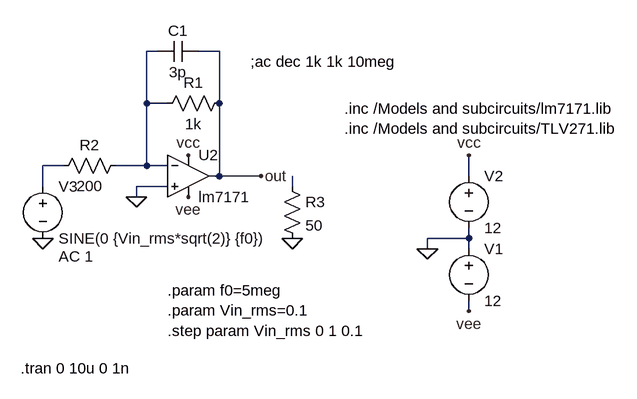
[diagram p0: schematic test_LM7171.asc]
test_LM7171.asc, the LTspice schematic file:
Version 4
SHEET 1 880 680
WIRE 32 32 16 32
WIRE 128 32 96 32
WIRE 16 112 16 32
WIRE 48 112 16 112
WIRE 128 112 128 32
WIRE -112 208 -144 208
WIRE 16 208 16 112
WIRE 16 208 -32 208
WIRE 48 208 16 208
WIRE 128 224 128 112
WIRE 128 224 112 224
WIRE 192 224 128 224
WIRE 512 224 512 192
WIRE -144 240 -144 208
WIRE 48 240 0 240
WIRE 240 240 240 224
WIRE 0 256 0 240
WIRE 512 320 512 304
WIRE 512 320 448 320
WIRE 448 336 448 320
WIRE 512 336 512 320
WIRE 512 432 512 416
FLAG 0 256 0
FLAG 448 336 0
FLAG 512 192 vcc
FLAG 80 192 vcc
FLAG 512 432 vee
FLAG 80 256 vee
FLAG -144 320 0
FLAG 240 320 0
FLAG 192 224 out
SYMBOL voltage 512 320 R0
WINDOW 123 0 0 Left 0
WINDOW 39 0 0 Left 0
SYMATTR InstName V1
SYMATTR Value 12
SYMBOL voltage 512 208 R0
WINDOW 123 0 0 Left 0
WINDOW 39 0 0 Left 0
SYMATTR InstName V2
SYMATTR Value 12
SYMBOL res 144 96 R90
WINDOW 0 0 56 VBottom 2
WINDOW 3 32 56 VTop 2
SYMATTR InstName R1
SYMATTR Value 1k
SYMBOL res -16 192 R90
WINDOW 0 0 56 VBottom 2
WINDOW 3 32 56 VTop 2
SYMATTR InstName R2
SYMATTR Value 200
SYMBOL voltage -144 224 R0
WINDOW 123 24 124 Left 2
WINDOW 39 0 0 Left 0
SYMATTR InstName V3
SYMATTR Value SINE(0 {Vin_rms*sqrt(2)} {f0})
SYMATTR Value2 AC 1
SYMBOL Opamps\\opamp2 80 160 R0
SYMATTR InstName U2
SYMATTR Value lm7171
SYMBOL res 224 224 R0
SYMATTR InstName R3
SYMATTR Value 50
SYMBOL cap 96 16 R90
WINDOW 0 0 32 VBottom 2
WINDOW 3 32 32 VTop 2
SYMATTR InstName C1
SYMATTR Value 3p
TEXT 320 120 Left 2 !.inc /Models and subcircuits/lm7171.lib\n.inc /Models and subcircuits/TLV271.lib
TEXT -178 520 Left 2 !.tran 0 10u 0 1n
TEXT 176 48 Left 2 !;ac dec 1k 1k 10meg
TEXT 48 400 Left 2 !.param f0=5meg\n.param Vin_rms=0.1\n.step param Vin_rms 0 1 0.1

The netlist it stands for:
* test_LM7171.asc
V1 0 vee 12
V2 vcc 0 12
R1 out N001 1k
R2 N001 N002 200
V3 N002 0 SINE(0 {Vin_rms*sqrt(2)} {f0}) AC 1
XU2 0 N001 vcc vee out lm7171  ; pins In+ In- V+ V- OUT
R3 N003 0 50
C1 out N001 3p
.inc /Models and subcircuits/lm7171.lib
.inc /Models and subcircuits/TLV271.lib
.tran 0 10u 0 1n
;ac dec 1k 1k 10meg
.param f0=5meg
.param Vin_rms=0.1
.step param Vin_rms 0 1 0.1
.backanno
.end